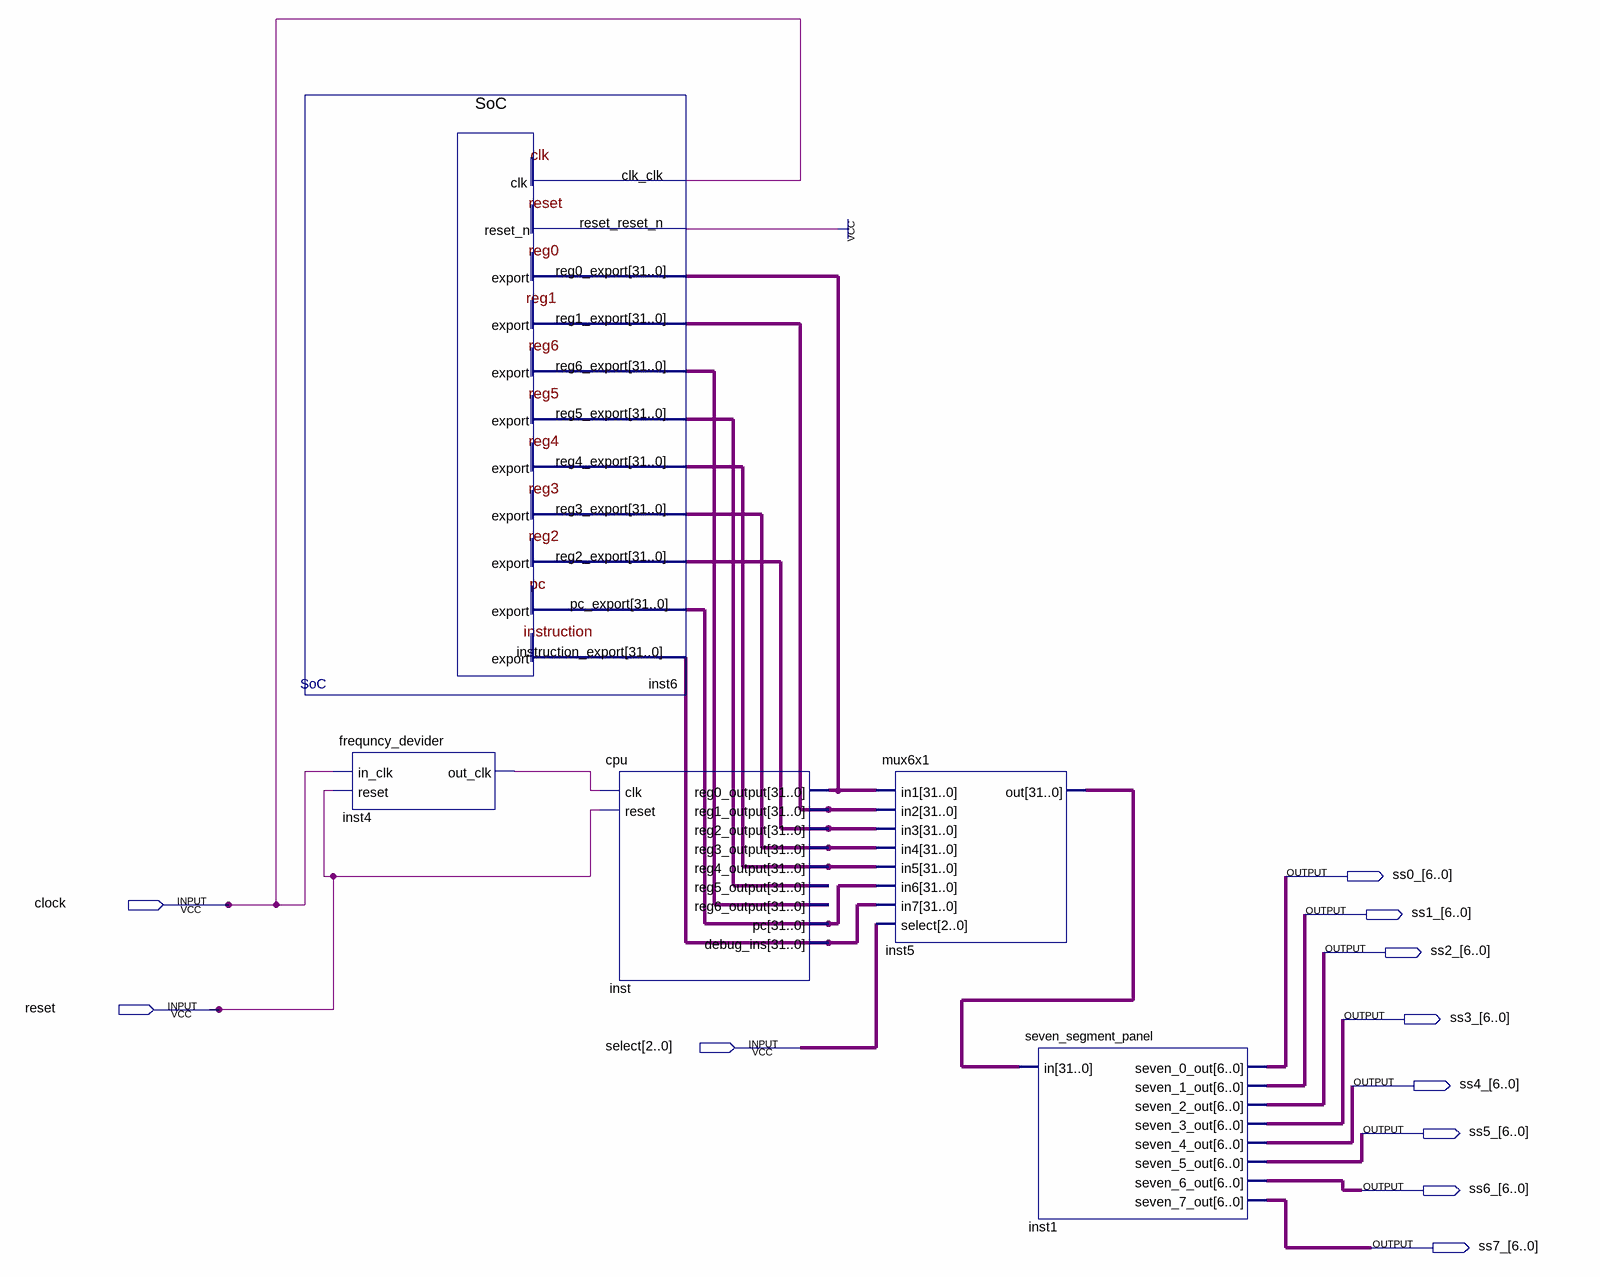
[diagram p0: schematic sheet]
// Quartus schematic RiscV_Processor.bdf as structural Verilog: 5 symbols, 11 pins
module RiscV_Processor (
  input  clock,
  input  reset,
  input  [2:0] select,
  output [6:0] ss0_,
  output [6:0] ss1_,
  output [6:0] ss2_,
  output [6:0] ss3_,
  output [6:0] ss4_,
  output [6:0] ss5_,
  output [6:0] ss6_,
  output [6:0] ss7_
);

  wire inst4_out_clk;
  wire [31:0] inst5_out, inst_debug_ins, inst_pc, inst_reg0_output, inst_reg1_output, inst_reg2_output,
       inst_reg3_output, inst_reg4_output, inst_reg5_output, inst_reg6_output;

  SoC inst6 (
    .clk_clk(clock), .reset_reset_n(1'b1), .reg0_export(inst_reg0_output), .reg1_export(inst_reg1_output),
    .reg6_export(inst_reg6_output), .reg5_export(inst_reg5_output), .reg4_export(inst_reg4_output),
    .reg3_export(inst_reg3_output), .reg2_export(inst_reg2_output), .pc_export(inst_pc),
    .instruction_export(inst_debug_ins));
  frequncy_devider inst4 (.in_clk(clock), .reset(reset), .out_clk(inst4_out_clk));
  cpu inst (
    .clk(inst4_out_clk), .reset(reset), .reg0_output(inst_reg0_output), .reg1_output(inst_reg1_output),
    .reg2_output(inst_reg2_output), .reg3_output(inst_reg3_output), .reg4_output(inst_reg4_output),
    .reg5_output(inst_reg5_output), .reg6_output(inst_reg6_output), .pc(inst_pc), .debug_ins(inst_debug_ins));
  mux6x1 inst5 (
    .in1(inst_reg0_output), .in2(inst_reg1_output), .in3(inst_reg2_output), .in4(inst_reg3_output),
    .in5(inst_reg4_output), .in6(inst_pc), .in7(inst_debug_ins), .select(select), .out(inst5_out));
  seven_segment_panel inst1 (
    .in(inst5_out), .seven_0_out(ss0_), .seven_1_out(ss1_), .seven_2_out(ss2_), .seven_3_out(ss3_),
    .seven_4_out(ss4_), .seven_5_out(ss5_), .seven_6_out(ss6_), .seven_7_out(ss7_));
endmodule
